# EAGLE design VL6180_Breakout (EAGLE 6.5.0)
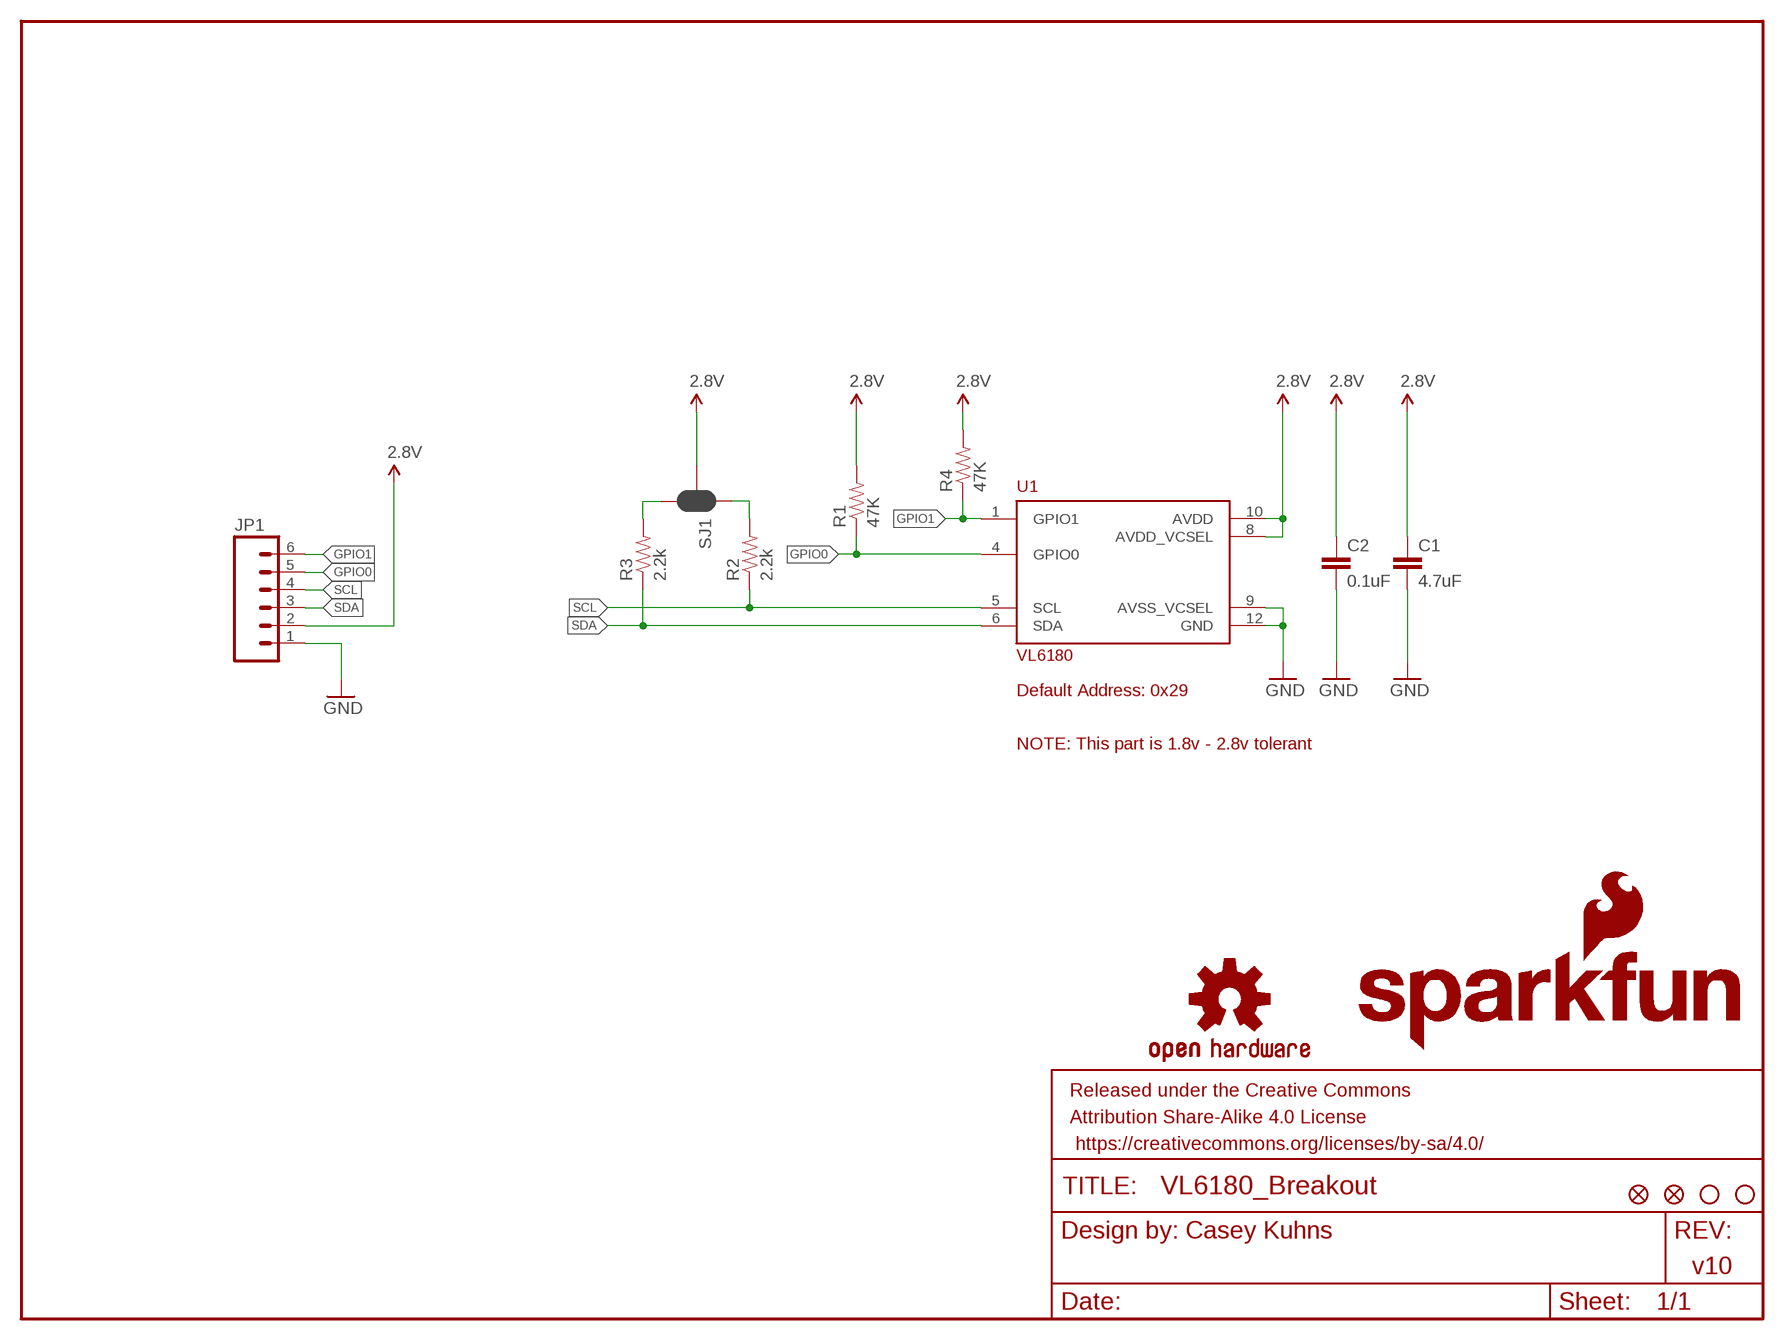
[diagram p0: schematic, sheet 1]

## Parts
C1  4.7uF  4.7UF-6.3V-10%(0603)0603  [0603-CAP]
C2  0.1uF  0.1UF-25V(+80/-20%)(0603)  [0603-CAP]
FID1  FIDUCIAL1X2  [FIDUCIAL-1X2]
FID2  FIDUCIAL1X2  [FIDUCIAL-1X2]
FRAME1  FRAME-LETTER  [CREATIVE_COMMONS]
JP1  M06SIP  [1X06]
LOGO1  SFE_LOGO_NAME_FLAME.1_INCH  [SFE_LOGO_NAME_FLAME_.1]
LOGO2  OSHW-LOGOS  [OSHW-LOGO-S]
R1  47K  47KOHM1/10W1%(0603)  [0603-RES]
R2  2.2k  2.2KOHM1/10W1%(0603)  [0603-RES]
R3  2.2k  2.2KOHM1/10W1%(0603)  [0603-RES]
R4  47K  47KOHM1/10W1%(0603)  [0603-RES]
SJ1  JUMPER-PAD-3-NC_BY_PASTE  [PAD-JUMPER-3-NC_BY_PASTE_YES_SILK_FULL_BOX]
STANDOFF1  STAND-OFF  [STAND-OFF]
STANDOFF2  STAND-OFF  [STAND-OFF]
U1  VL6180  [VL6180]

## Nets
2.8V: C1.1 C2.1 JP1.2 R1.2 R4.2 SJ1.2 U1.8(AVDD_VCSEL) U1.10(AVDD)
GND: C1.2 C2.2 JP1.1 U1.9(AVSS_VCSEL) U1.12(GND)
GPIO0: JP1.5 R1.1 U1.4(GPIO0)
GPIO1: JP1.6 R4.1 U1.1(GPIO1)
N$1: R2.2 SJ1.1
N$2: R3.2 SJ1.3
SCL: JP1.4 R2.1 U1.5(SCL)
SDA: JP1.3 R3.1 U1.6(SDA)

## Notes on the sheet
- Default Address: 0x29
- NOTE: This part is 1.8v - 2.8v tolerant
- Casey Kuhns
- v10

## Library data of the parts
C1 = SparkFun-Capacitors:4.7UF-6.3V-10%(0603): CAP-08280; PROD_ID: CAP-08280
C2 = SparkFun-Capacitors:0.1UF-25V(+80/-20%)(0603): CAP-00810 Ceramic Standard decoupling cap; PROD_ID: CAP-00810
FID1 FID2 = SparkFun-Aesthetics:FIDUCIAL: Fiducial Alignment Points Various fiducial points for machine vision alignment.
FRAME1 = SparkFun-Aesthetics:FRAME-LETTER: Schematic Frame Standard 8.5x11 US Letter frame
JP1 = SparkFun-Connectors:M06: Header 6 Standard 6-pin 0.1" header. Use with straight break away headers (SKU : PRT-00116), right angle break away headers (PRT-00553), swiss pins (PRT-00743), machine pins (PRT-00117), and female headers (PRT-00115). Molex polarized connector foot print use with SKU : PRT-08094 with associated crimp pins and housings. NOTES ON THE VARIANTS LOCK and LOCK_LONGPADS... This footprint was designed to help hold the alignment of a through-hole component (i.e. 6-pin header) while soldering it into place. You may notice that each hole has been shifted either up or down by 0.005 of an inch from it's more standard position (which is a perfectly straight line). This slight alteration caused the pins (the squares in the middle) to touch the edges of the holes. Because they are alternating, it causes a "brace" to hold the component in place. 0.005 has proven to be the perfect amount of "off-center" position when using our standard breakaway headers. Although looks a little odd when you look at the bare footprint, once you have a header in there, the alteration is very hard to notice. Also,if you push a header all the way into place, it is covered up entirely on the bottom side. This idea of altering the position of holes to aid alignment will be further integrated into the Sparkfun Library for other footprints. It can help hold any component with 3 or more connection pins.
LOGO1 = SparkFun-Aesthetics:SFE_LOGO_NAME_FLAME: SFE Logo, name and flame This is the SparkFun full logo. The logo on the schematic will always be the same size; the package variant is the height of the flame part of the logo. Default layer for the logo on the board is tSilk.
LOGO2 = SparkFun-Aesthetics:OSHW-LOGO: Open Source Hardware Logo This logo indicates the piece of hardware it is found on incorporates a OSHW license and/or adheres to the definition of open source hardware found here: http://freedomdefined.org/OSHW
R1 R4 = SparkFun-Resistors:47KOHM1/10W1%(0603): RES-07871; PROD_ID: RES-07871
R2 R3 = SparkFun-Resistors:2.2KOHM1/10W1%(0603): RES-08272; PROD_ID: RES-08272
SJ1 = SparkFun-Passives:JUMPER-PAD-3-NC_BY_PASTE
STANDOFF1 STANDOFF2 = SparkFun-Electromechanical:STAND-OFF: #4 Stand Off This is the mechanical footprint for a #4 phillips button head screw. Use the keepout ring to avoid running the screw head into surrounding components. SKU : PRT-00447
U1 = VL6180:VL6180; PROD_ID: IC-12007

## Board
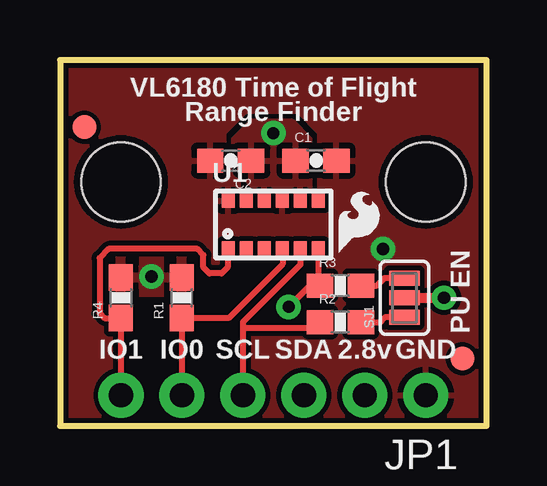
[diagram p1: board, top side]
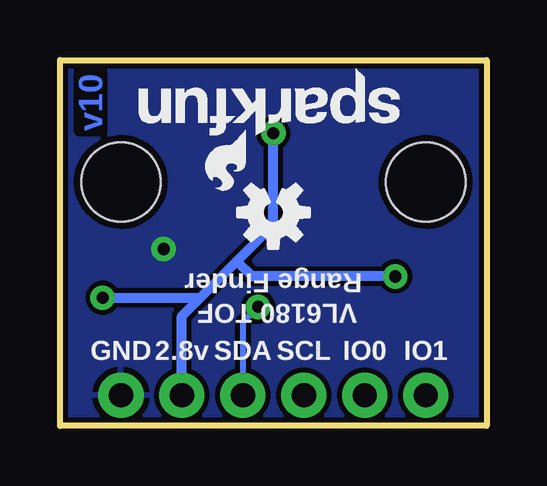
[diagram p2: board, bottom side, seen from below]

Size 17.78 x 15.24 mm. Coordinates in mm from the lower left corner, seen from the top.
Outline: 0,0 17.78,0 17.78,15.24 0,15.24 0,0
Copper layers (1*16): Top 0.035mm / dielectric 1.5mm / Bottom 0.035mm
Design rules "SparkFun-2-layer": minimum track width 7mil, minimum drill 15mil, track to track 8mil, track to pad 8mil, pad to pad 8mil, via to via 8mil, smd to smd 8mil, copper to edge 8mil, drill to drill 8mil, minimum pad ring 12mil, minimum via ring 10mil, stop-mask expansion 4mil, vias tented up to drill 20mil, thermal gap 10mil

### Footprints (pad centres in the part's own frame; a part is rotated, then mirrored left to right if it is on the bottom)
0603-CAP = smd 1.1 x 1: 1 -0.85,0; 2 0.85,0
FIDUCIAL-1X2 = smd 1 x 1: 1 0,0
1X06 = drill 1.016 pad 1.88: 1 0,0; 2 2.54,0; 3 5.08,0; 4 7.62,0; 5 10.16,0; 6 12.7,0
0603-RES = smd 1.1 x 1: 1 -0.85,0; 2 0.85,0
PAD-JUMPER-3-NC_BY_PASTE_YES_SILK_FULL_BOX = smd 0.635 x 1.27: 1 -0.813,0; 2 0,0; 3 0.813,0
STAND-OFF = hole 3.302: 0,0
VL6180 = smd 0.55 x 0.6: 1 -1.875,-1; 2 -1.125,-1; 3 -0.375,-1; 4 0.375,-1; 5 1.125,-1; 6 1.875,-1; 7 1.875,1; 8 1.125,1; 9 0.375,1; 10 -0.375,1; 11 -1.125,1; 12 -1.875,1

### Placement (x,y rotation side)
C1  10.67,11.05 0 top
C2  7.11,11.05 180 top
FID1  16.76,2.79 0 top
FID2  1.02,12.45 0 top
FRAME1  0,-9.5 0 top  (outside the outline)
JP1  15.24,1.27 180 top
LOGO1  3.17,14.99 180 bottom
LOGO2  8.89,8.89 180 bottom
R1  5.08,5.33 90 top
R2  11.68,4.32 0 top
R3  11.68,5.84 0 top
R4  2.54,5.33 90 top
SJ1  14.35,5.33 90 top
STANDOFF1  2.54,10.16 0 top
STANDOFF2  15.24,10.16 0 top
U1  8.89,8.38 0 top
U$2  [SFE_LOGO_FLAME_.1]  11.3,6.86 0 top

### Tracks (layer width: path | path; a pad name or v marks a point on that pad's centre or on a via)
2.8V  (via drill 0.51)
  Top 0.406: SJ1.2 v16,5.33
  Bottom 0.406: JP1.2 12.7,4.57 11.94,5.33 | 11.94,5.33 10.48,6.79 | 10.48,6.79 8.89,8.38 v8.89,12.19 | v3.81,6.22 9.78,6.22 10.35,6.79 10.48,6.79 | v16,5.33 11.94,5.33
  pour Top: 9.65,12.7 10.41,11.94 10.41,9.4 9.91,9.4 9.91,9.91 8.76,9.91 8.76,9.4 8.26,9.4 8.26,9.78 7.62,10.41 7.24,10.41 7.24,11.94 8,12.7
  pour Top: 2.29,5.59 5.33,5.59 5.33,6.86 2.29,6.86
GND  (via drill 0.51)
  other vias: 13.46,7.37
  pour Bottom (rank 6): 0,15.24 17.78,15.24 17.78,0 0,0
  pour Top (rank 6): 0,15.24 17.78,15.24 17.78,0 0,0
GPIO0
  Top 0.254: U1.4 9.27,6.73 7.02,4.48 R1.1 JP1.5
GPIO1
  Top 0.254: U1.1 6.99,7.35 6.99,6.6 6.73,6.35 6.22,6.35 5.97,6.6 5.97,7.11 5.71,7.37 2.03,7.37 1.65,6.99 1.65,4.7 1.87,4.48 R4.1 JP1.6
N$1
  Top 0.254: R2.2 13.34,4.32 13.54,4.52 SJ1.1
N$2
  Top 0.254: R3.2 13.21,5.84 13.51,6.15 SJ1.3
SCL
  Top 0.254: U1.5 10.02,6.71 7.62,4.32 7.62,4.06 | 7.62,4.06 JP1.4 | R2.1 10.58,4.06 7.62,4.06
SDA  (via drill 0.51)
  Top 0.254: U1.6 10.77,5.84 | 10.77,5.84 R3.1 | 10.77,5.84 10.41,5.84 v9.53,4.95
  Bottom 0.254: v9.53,4.95 10.16,4.32 JP1.3

### Text on the board
Bottom: v10
tPlace: VL6180 Time of Flight | Range Finder | PU EN | IO1 | IO0 | SCL | SDA | 2.8v | GND
bPlace: Range Finder | VL6180 TOF | IO1 | IO0 | SCL | SDA | 2.8v | GND
tDocu: Casey Kuhns